# Altium schematic sheet 2-RJ45.SchDoc
size A3
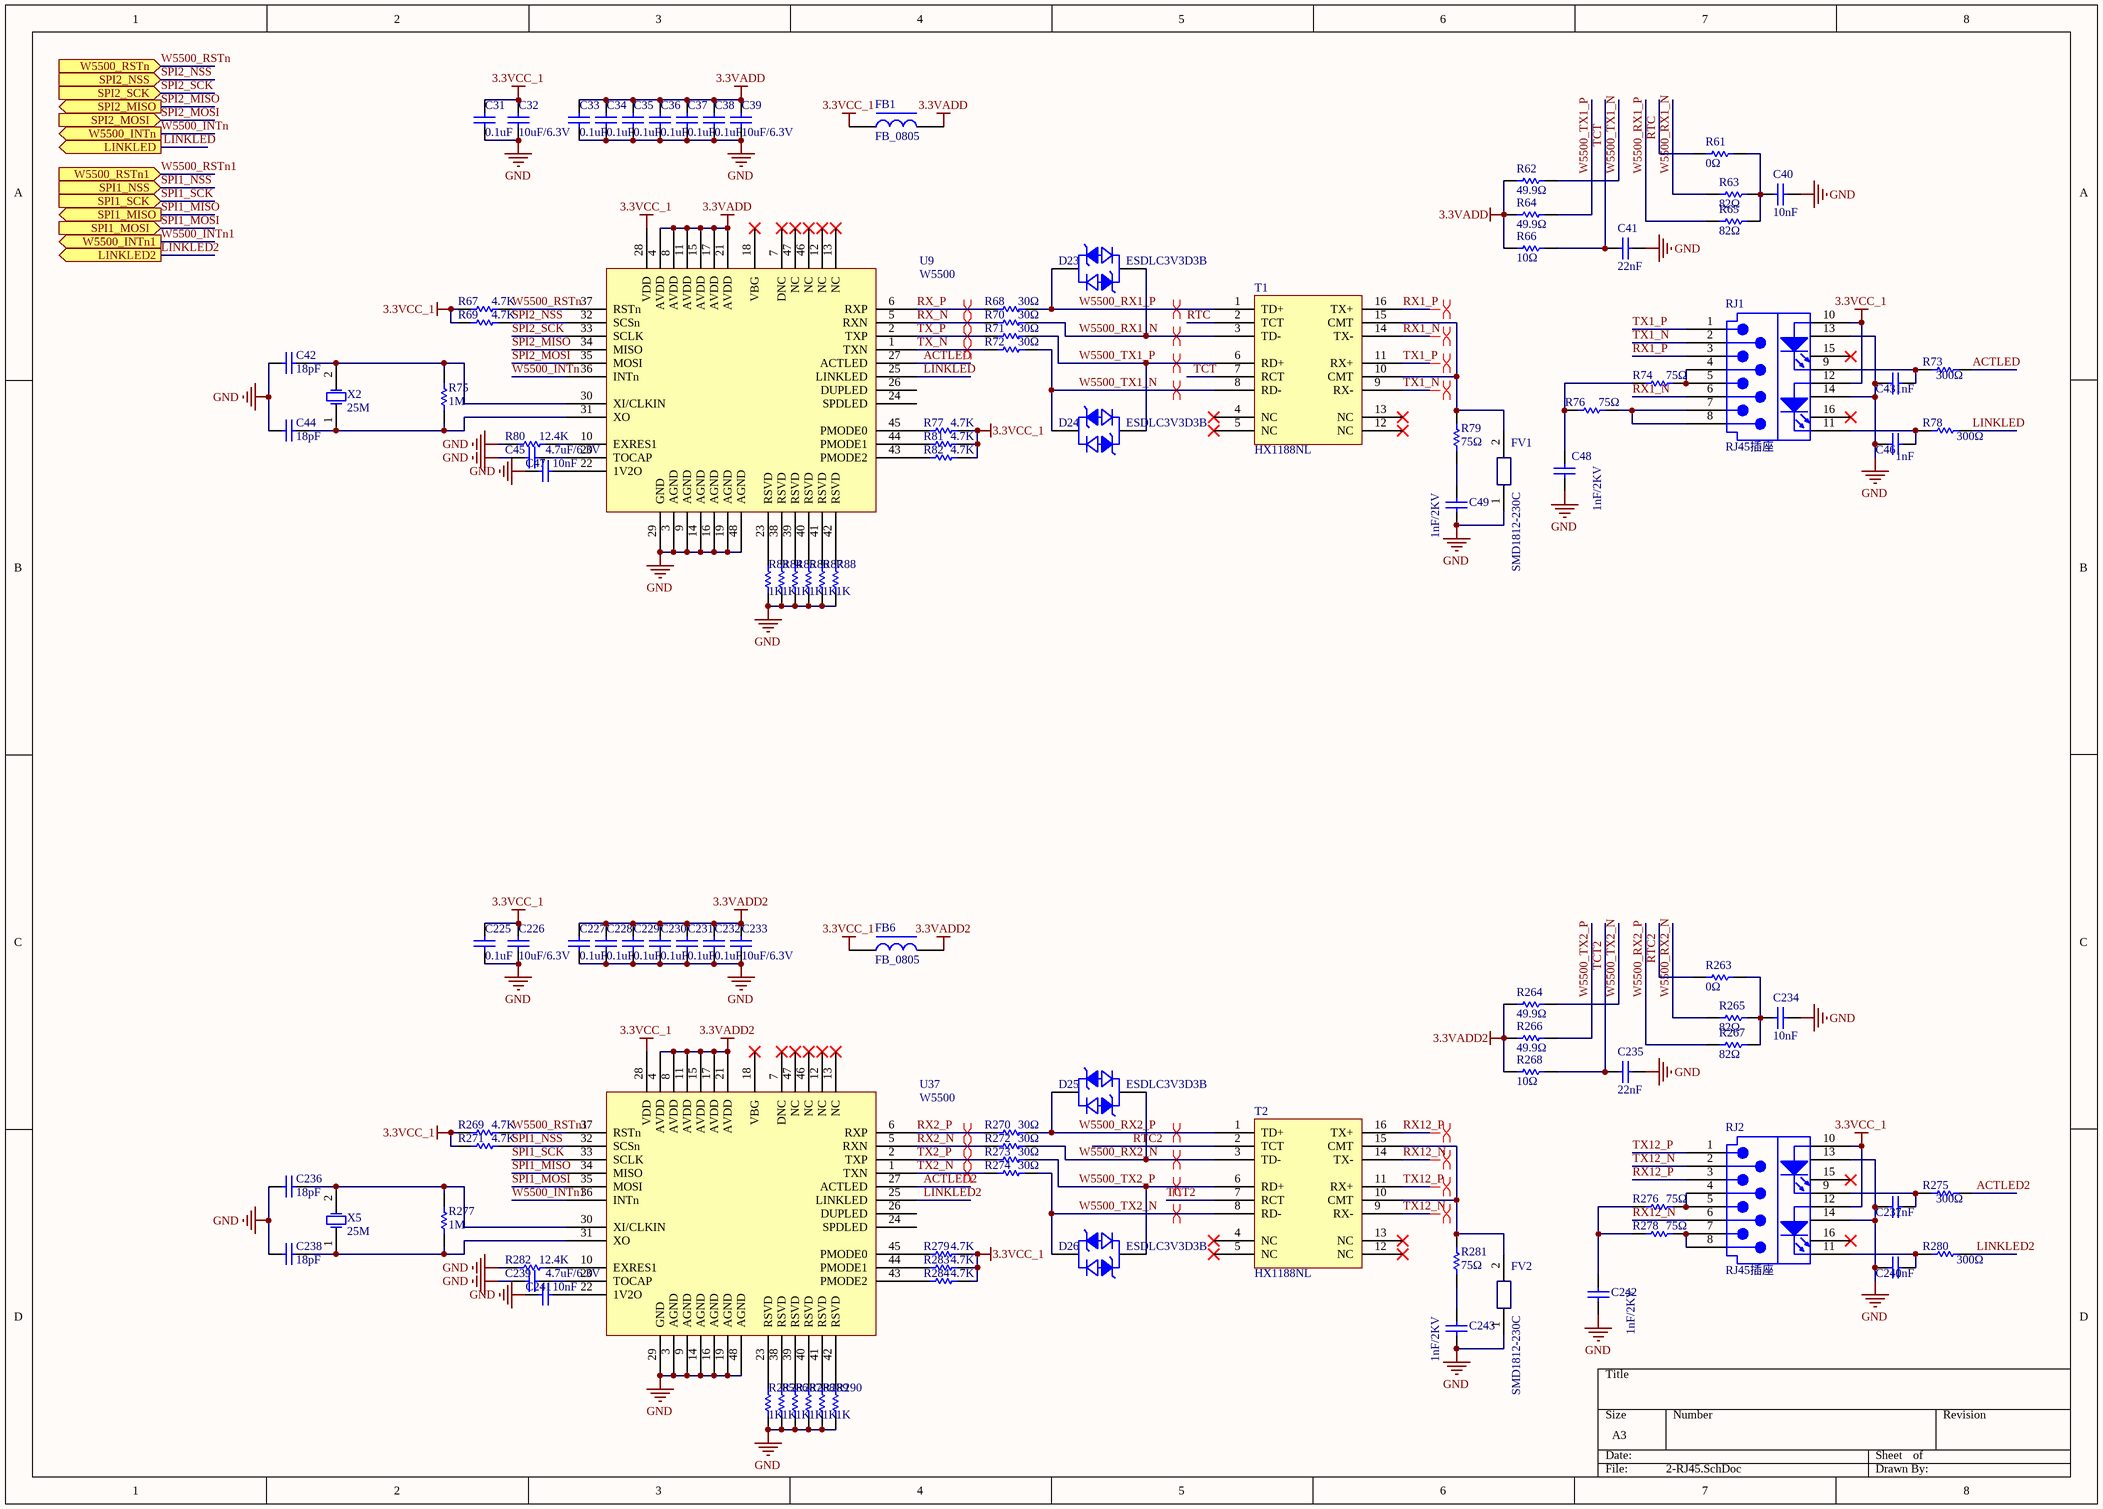
[diagram p0: 2-RJ45.SchDoc]

## Parts
C31  0.1uF  [C0603]
C32  10uF/6.3V  [C0603]
C33  0.1uF  [C0603]
C34  0.1uF  [C0603]
C35  0.1uF  [C0603]
C36  0.1uF  [C0603]
C37  0.1uF  [C0603]
C38  0.1uF  [C0603]
C39  10uF/6.3V  [C0603]
C40  10nF  [C0603]
C41  22nF  [C0603]
C42  18pF  [C0603]
C43  1nF  [C0603]
C44  18pF  [C0603]
C45  4.7uF/6.3V  [C0603]
C46  1nF  [C0603]
C47  10nF  [C0603]
C48  1nF/2KV  [C1206]
C49  1nF/2KV  [C1206]
C225  0.1uF  [C0603]
C226  10uF/6.3V  [C0603]
C227  0.1uF  [C0603]
C228  0.1uF  [C0603]
C229  0.1uF  [C0603]
C230  0.1uF  [C0603]
C231  0.1uF  [C0603]
C232  0.1uF  [C0603]
C233  10uF/6.3V  [C0603]
C234  10nF  [C0603]
C235  22nF  [C0603]
C236  18pF  [C0603]
C237  1nF  [C0603]
C238  18pF  [C0603]
C239  4.7uF/6.3V  [C0603]
C240  1nF  [C0603]
C241  10nF  [C0603]
C242  1nF/2KV  [C1206]
C243  1nF/2KV  [C1206]
D23  ESDLC3V3D3B  [SOD-323]
D24  ESDLC3V3D3B  [SOD-323]
D25  ESDLC3V3D3B  [SOD-323]
D26  ESDLC3V3D3B  [SOD-323]
FB1  FB_0805  [L0805]
FB6  FB_0805  [L0805]
FV1  SMD1812-230C  [D1812]
FV2  SMD1812-230C  [D1812]
R61  0Ω  [R0603]
R62  49.9Ω  [R0603]
R63  82Ω  [R0603]
R64  49.9Ω  [R0603]
R65  82Ω  [R0603]
R66  10Ω  [R0603]
R67  4.7K  [R0603]
R68  30Ω  [R0603]
R69  4.7K  [R0603]
R70  30Ω  [R0603]
R71  30Ω  [R0603]
R72  30Ω  [R0603]
R73  300Ω  [R0603]
R74  75Ω  [R0805]
R75  1M  [R0603]
R76  75Ω  [R0805]
R77  4.7K  [R0603]
R78  300Ω  [R0603]
R79  75Ω  [R1206]
R80  12.4K  [R0603]
R81  4.7K  [R0603]
R82  4.7K  [R0603]
R83  1K  [R0603]
R84  1K  [R0603]
R85  1K  [R0603]
R86  1K  [R0603]
R87  1K  [R0603]
R88  1K  [R0603]
R263  0Ω  [R0603]
R264  49.9Ω  [R0603]
R265  82Ω  [R0603]
R266  49.9Ω  [R0603]
R267  82Ω  [R0603]
R268  10Ω  [R0603]
R269  4.7K  [R0603]
R270  30Ω  [R0603]
R271  4.7K  [R0603]
R272  30Ω  [R0603]
R273  30Ω  [R0603]
R274  30Ω  [R0603]
R275  300Ω  [R0603]
R276  75Ω  [R0805]
R277  1M  [R0603]
R278  75Ω  [R0805]
R279  4.7K  [R0603]
R280  300Ω  [R0603]
R281  75Ω  [R1206]
R282  12.4K  [R0603]
R283  4.7K  [R0603]
R284  4.7K  [R0603]
R285  1K  [R0603]
R286  1K  [R0603]
R287  1K  [R0603]
R288  1K  [R0603]
R289  1K  [R0603]
R290  1K  [R0603]
RJ1  RJ45插座  [RJ45TH-1x1-2R54-LED]
RJ2  RJ45插座  [RJ45TH-1x1-2R54-LED]
T1  HX1188NL  [SOP16-1R27-7R11x12R7]
T2  HX1188NL  [SOP16-1R27-7R11x12R7]
U9  W5500  [TQFN48-0R5-7X7]
U37  W5500  [TQFN48-0R5-7X7]
X2  25M  [CRY2SM-6R0x3R5]
X5  25M  [CRY2SM-6R0x3R5]

## Ports
LINKLED2 (out), LINKLED (out), SPI1_MISO (out), SPI1_MOSI (in), SPI1_NSS (in), SPI1_SCK (in), SPI2_MISO (out), SPI2_MOSI (in), SPI2_NSS (in), SPI2_SCK (in), W5500_INTn1 (out), W5500_INTn (out), W5500_RSTn1 (in), W5500_RSTn (in)

## Nets
3.3VADD: C33.2 C34.2 C35.2 C36.2 C37.2 C38.2 C39.2 FB1.2 R62.2 R64.2 R66.2 U9.4(AVDD) U9.8(AVDD) U9.11(AVDD) U9.15(AVDD) U9.17(AVDD) U9.21(AVDD)
3.3VADD2: C227.2 C228.2 C229.2 C230.2 C231.2 C232.2 C233.2 FB6.2 R264.2 R266.2 R268.2 U37.4(AVDD) U37.8(AVDD) U37.11(AVDD) U37.15(AVDD) U37.17(AVDD) U37.21(AVDD)
3.3VCC_1: C31.2 C32.2 C225.2 C226.2 FB1.1 FB6.1 R67.2 R69.2 R77.2 R81.2 R82.2 R269.2 R271.2 R279.2 R283.2 R284.2 RJ1.10(A1) RJ1.12(A2) RJ2.10(A1) RJ2.12(A2) U9.28(VDD) U37.28(VDD)
GND: C31.1 C32.1 C33.1 C34.1 C35.1 C36.1 C37.1 C38.1 C39.1 C40.1 C41.1 C42.1 C43.1 C44.1 C45.1 C46.1 C47.2 C48.1 C49.1 C225.1 C226.1 C227.1 C228.1 C229.1 C230.1 C231.1 C232.1 C233.1 C234.1 C235.1 C236.1 C237.1 C238.1 C239.1 C240.1 C241.2 C242.1 C243.1 FV1.1 FV2.1 R80.1 R83.1 R84.1 R85.1 R86.1 R87.1 R88.1 R282.1 R285.1 R286.1 R287.1 R288.1 R289.1 R290.1 RJ1.13 RJ1.14 RJ2.13 RJ2.14 U9.3(AGND) U9.9(AGND) U9.14(AGND) U9.16(AGND) U9.19(AGND) U9.29(GND) U9.48(AGND) U37.3(AGND) U37.9(AGND) U37.14(AGND) U37.16(AGND) U37.19(AGND) U37.29(GND) U37.48(AGND)
ACTLED: R73.2 U9.27(ACTLED)
ACTLED2: R275.2 U37.27(ACTLED)
LINKLED: R78.2 U9.25(LINKLED) ; port LINKLED
LINKLED2: R280.2 U37.25(LINKLED) ; port LINKLED2
RTC: R61.2 T1.2(TCT)
RTC2: R263.2 T2.2(TCT)
RX1_N: RJ1.6(RX-) T1.14(TX-)
RX1_P: RJ1.3(RX+) T1.16(TX+)
RX2_N: R272.1 U37.5(RXN)
RX2_P: R270.1 U37.6(RXP)
RX12_N: RJ2.6(RX-) T2.14(TX-)
RX12_P: RJ2.3(RX+) T2.16(TX+)
RX_N: R70.1 U9.5(RXN)
RX_P: R68.1 U9.6(RXP)
SPI1_MISO: U37.34(MISO) ; port SPI1_MISO
SPI1_MOSI: U37.35(MOSI) ; port SPI1_MOSI
SPI1_NSS: R271.1 U37.32(SCSn) ; port SPI1_NSS
SPI1_SCK: U37.33(SCLK) ; port SPI1_SCK
SPI2_MISO: U9.34(MISO) ; port SPI2_MISO
SPI2_MOSI: U9.35(MOSI) ; port SPI2_MOSI
SPI2_NSS: R69.1 U9.32(SCSn) ; port SPI2_NSS
SPI2_SCK: U9.33(SCLK) ; port SPI2_SCK
TCT: C41.2 R66.1 T1.7(RCT)
TCT2: C235.2 R268.1 T2.7(RCT)
TX1_N: RJ1.2(TX-) T1.9(RX-)
TX1_P: RJ1.1(TX+) T1.11(RX+)
TX2_N: R274.1 U37.1(TXN)
TX2_P: R273.1 U37.2(TXP)
TX12_N: RJ2.2(TX-) T2.9(RX-)
TX12_P: RJ2.1(TX+) T2.11(RX+)
TX_N: R72.1 U9.1(TXN)
TX_P: R71.1 U9.2(TXP)
W5500_INTn: U9.36(INTn) ; port W5500_INTn
W5500_INTn1: U37.36(INTn) ; port W5500_INTn1
W5500_RSTn: R67.1 U9.37(RSTn) ; port W5500_RSTn
W5500_RSTn1: R269.1 U37.37(RSTn) ; port W5500_RSTn1
W5500_RX1_N: D23.2 R63.2 R70.2 T1.3(TD-)
W5500_RX1_P: D23.1 R65.2 R68.2 T1.1(TD+)
W5500_RX2_N: D25.2 R265.2 R272.2 T2.3(TD-)
W5500_RX2_P: D25.1 R267.2 R270.2 T2.1(TD+)
W5500_TX1_N: D24.1 R62.1 R72.2 T1.8(RD-)
W5500_TX1_P: D24.2 R64.1 R71.2 T1.6(RD+)
W5500_TX2_N: D26.1 R264.1 R274.2 T2.8(RD-)
W5500_TX2_P: D26.2 R266.1 R273.2 T2.6(RD+)
NetC40_2: C40.2 R61.1 R63.1 R65.1
NetC42_2: C42.2 R75.2 U9.30(XI/CLKIN) X2.2(OSC2)
NetC43_2: C43.2 R73.1 RJ1.9(K1)
NetC44_2: C44.2 R75.1 U9.31(XO) X2.1(OSC1)
NetC45_2: C45.2 U9.20(TOCAP)
NetC46_2: C46.2 R78.1 RJ1.11(K2)
NetC47_1: C47.1 U9.22(1V2O)
NetC48_2: C48.2 R74.1 R76.1
NetC49_2: C49.2 R79.1
NetC234_2: C234.2 R263.1 R265.1 R267.1
NetC236_2: C236.2 R277.2 U37.30(XI/CLKIN) X5.2(OSC2)
NetC237_2: C237.2 R275.1 RJ2.9(K1)
NetC238_2: C238.2 R277.1 U37.31(XO) X5.1(OSC1)
NetC239_2: C239.2 U37.20(TOCAP)
NetC240_2: C240.2 R280.1 RJ2.11(K2)
NetC241_1: C241.1 U37.22(1V2O)
NetC242_2: C242.2 R276.1 R278.1
NetC243_2: C243.2 R281.1
NetFV1_2: FV1.2 R79.2 T1.10(CMT) T1.15(CMT)
NetFV2_2: FV2.2 R281.2 T2.10(CMT) T2.15(CMT)
NetR74_2: R74.2 RJ1.4(NC) RJ1.5(NC)
NetR76_2: R76.2 RJ1.7(NC) RJ1.8(NC)
NetR77_1: R77.1 U9.45(PMODE0)
NetR80_2: R80.2 U9.10(EXRES1)
NetR81_1: R81.1 U9.44(PMODE1)
NetR82_1: R82.1 U9.43(PMODE2)
NetR83_2: R83.2 U9.23(RSVD)
NetR84_2: R84.2 U9.38(RSVD)
NetR85_2: R85.2 U9.39(RSVD)
NetR86_2: R86.2 U9.40(RSVD)
NetR87_2: R87.2 U9.41(RSVD)
NetR88_2: R88.2 U9.42(RSVD)
NetR276_2: R276.2 RJ2.4(NC) RJ2.5(NC)
NetR278_2: R278.2 RJ2.7(NC) RJ2.8(NC)
NetR279_1: R279.1 U37.45(PMODE0)
NetR282_2: R282.2 U37.10(EXRES1)
NetR283_1: R283.1 U37.44(PMODE1)
NetR284_1: R284.1 U37.43(PMODE2)
NetR285_2: R285.2 U37.23(RSVD)
NetR286_2: R286.2 U37.38(RSVD)
NetR287_2: R287.2 U37.39(RSVD)
NetR288_2: R288.2 U37.40(RSVD)
NetR289_2: R289.2 U37.41(RSVD)
NetR290_2: R290.2 U37.42(RSVD)

Not connected (* = marked no-connect by the designer): RJ1 15* 16*; RJ2 15* 16*; T1 4(NC)* 5(NC)* 12(NC)* 13(NC)*; T2 4(NC)* 5(NC)* 12(NC)* 13(NC)*; U9 7(DNC)* 12(NC)* 13(NC)* 18(VBG)* 24(SPDLED) 26(DUPLED) 46(NC)* 47(NC)*; U37 7(DNC)* 12(NC)* 13(NC)* 18(VBG)* 24(SPDLED) 26(DUPLED) 46(NC)* 47(NC)*

## Layout directives
differential pair: RX1_N, RX1_P, RX2_N, RX2_P, RX12_N, RX12_P, RX_N, RX_P, TX1_N, TX1_P, TX2_N, TX2_P, TX12_N, TX12_P, TX_N, TX_P, W5500_RX1_N, W5500_RX1_P, W5500_RX2_N, W5500_RX2_P, W5500_TX1_N, W5500_TX1_P, W5500_TX2_N, W5500_TX2_P

## Library data of the parts
C31 C33-C38 C225 C227-C232 = 0.1uF贴片电容: 贴片电容_GRM188R71H104KA01D_0.1uF±10%,50V,0603; code: 01010045
C32 C39 C226 C233 = 10uF贴片电容: 贴片电容_GRM188R60J106ME47D_10uF±20%,6.3V,0603; code: 01010037
C40 C47 C234 C241 = 0.1uF贴片电容: C0603C103K5RAC_10nF±10%,50V,0603; MPN: KEMET; code: 01010218
C41 C235 = 27nF贴片电容: 贴片电容_22nF±5%,50V,0603; code: 01010054
C42 C44 C236 C238 = 18pF贴片电容: 贴片电容_GRM1885C1H180JA01D_18pF±5%,50V,0603; code: 01010102
C43 C46 C237 C240 = 1000pF贴片电容: 贴片电容_GRM188R71H102KA01_1000pF±10%,50V,0603; code: 01010093
C45 C239 = 1uF贴片电容: GRM188R61C475K_4.7uF±10%,16V,0603; MPN: Murata; code: 01010098
C48 C49 = 10uF贴片电容: 贴片电容_1206B102K202NT_1206,1000PF/2KV; MPN: 风华; code: 01010100
C242 C243 = 10uF贴片电容: 贴片电容_1000pF/2KV
D23-D26 = ESDLC3V3D3B: ESD_ESDLC3V3D3B _SOD-323封装
FB1 FB6 = 0805贴片磁珠: 贴片磁珠_600R,0805; code: 01030023
FV1 FV2 = 4532-401-LF: 贴片陶瓷气体放电管_SMD1812-230C_1812,230V,2KA; MPN: Littelfuse; code: 01070013
R61 R263 = 0Ω贴片电阻: 贴片电阻_0Ω±5%,0603; code: 01020010
R62 R64 R264 R266 = 51Ω贴片电阻: 贴片电阻_49.9Ω±1%,0603; code: 01020126
R63 R65 R265 R267 = 51Ω贴片电阻: 贴片电阻_82Ω±1%,0603; code: 01020196
R66 R268 = 10Ω贴片电阻: 贴片电阻_10Ω±5%,0603; code: 01020104
R67 R69 R77 R81 R82 R269 R271 R279 R283 R284 = 4.7K贴片电阻: 贴片电阻_4.7K±5%,0603; code: 01020012
R68 R70-R72 R270 R272-R274 = 30Ω贴片电阻: 贴片电阻_30Ω±5%,0603; code: 01020108
R73 R78 R275 R280 = 300Ω贴片电阻: 贴片电阻_300Ω±5%,0603; code: 01020008
R74 R76 R276 R278 = 75Ω贴片电阻: 贴片电阻_75Ω±5%,0805; code: 01020068
R75 R277 = 1M贴片电阻: 贴片电阻_1M±5%,0603; code: 01020093
R79 R281 = 75Ω贴片电阻: 贴片电阻_75Ω±5%,1206; code: 01020197
R80 R282 = 12K贴片电阻: 贴片电阻_12.4K±1%,0603
R83-R88 R285-R290 = 1K贴片电阻: 贴片电阻_1K±5%,0603; code: 01020082
RJ1 RJ2 = RJ45弯脚带灯: RJ45插座_1*1,带左黄右绿灯,弯脚; MPN: 朱迅; code: 01090042
T1 T2 = HX1188NL: 网络变压器_HX1188NL_百兆,SOIC16; code: 01060114
U9 U37 = W5500: 以太网控制器_W5500_LQFP48; code: 01060113
X2 = 25M贴片无源晶体: 贴片无源晶体_25MHz,30ppm,6035封装; code: 03050012
X5 = 8M贴片无源晶体: 贴片无源晶体_25MHz,封装6035